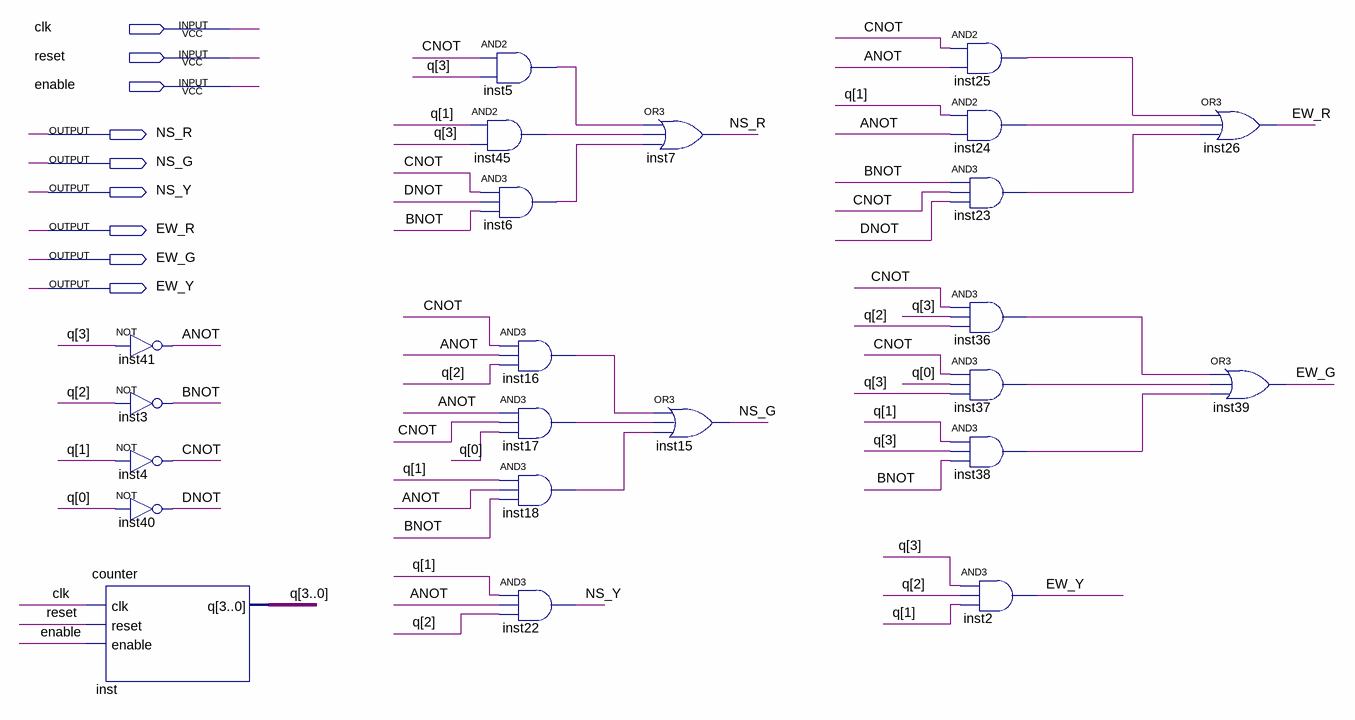
[diagram p0: schematic sheet]
// Quartus schematic traffic.bdf as structural Verilog: 23 symbols, 9 pins
module traffic (
  input  clk,
  input  reset,
  input  enable,
  output NS_R,
  output NS_G,
  output NS_Y,
  output EW_R,
  output EW_G,
  output EW_Y
);

  wire ANOT, BNOT, CNOT, DNOT, inst5_out, inst6_out, inst16_out, inst17_out, inst18_out, inst23_out,
       inst24_out, inst25_out, inst36_out, inst37_out, inst38_out, inst45_out;
  wire [3:0] q;

  counter inst (.clk(clk), .reset(reset), .enable(enable), .q(q));
  not inst41 (ANOT, q[3]);
  not inst3 (BNOT, q[2]);
  not inst4 (CNOT, q[1]);
  not inst40 (DNOT, q[0]);
  and inst5 (inst5_out, CNOT, q[3]);
  and inst45 (inst45_out, q[1], q[3]);
  and inst6 (inst6_out, CNOT, DNOT, BNOT);
  and inst16 (inst16_out, CNOT, ANOT, q[2]);
  and inst17 (inst17_out, ANOT, CNOT, q[0]);
  and inst18 (inst18_out, q[1], ANOT, BNOT);
  and inst22 (NS_Y, q[1], ANOT, q[2]);
  or inst7 (NS_R, inst5_out, inst45_out, inst6_out);
  or inst15 (NS_G, inst16_out, inst17_out, inst18_out);
  and inst25 (inst25_out, CNOT, ANOT);
  and inst24 (inst24_out, q[1], ANOT);
  and inst23 (inst23_out, BNOT, CNOT, DNOT);
  and inst36 (inst36_out, CNOT, q[3], q[2]);
  and inst37 (inst37_out, CNOT, q[0], q[3]);
  and inst38 (inst38_out, q[1], q[3], BNOT);
  and inst2 (EW_Y, q[3], q[2], q[1]);
  or inst26 (EW_R, inst25_out, inst24_out, inst23_out);
  or inst39 (EW_G, inst36_out, inst37_out, inst38_out);
endmodule
